# EAGLE design EthernetBridge (EAGLE 6.1)
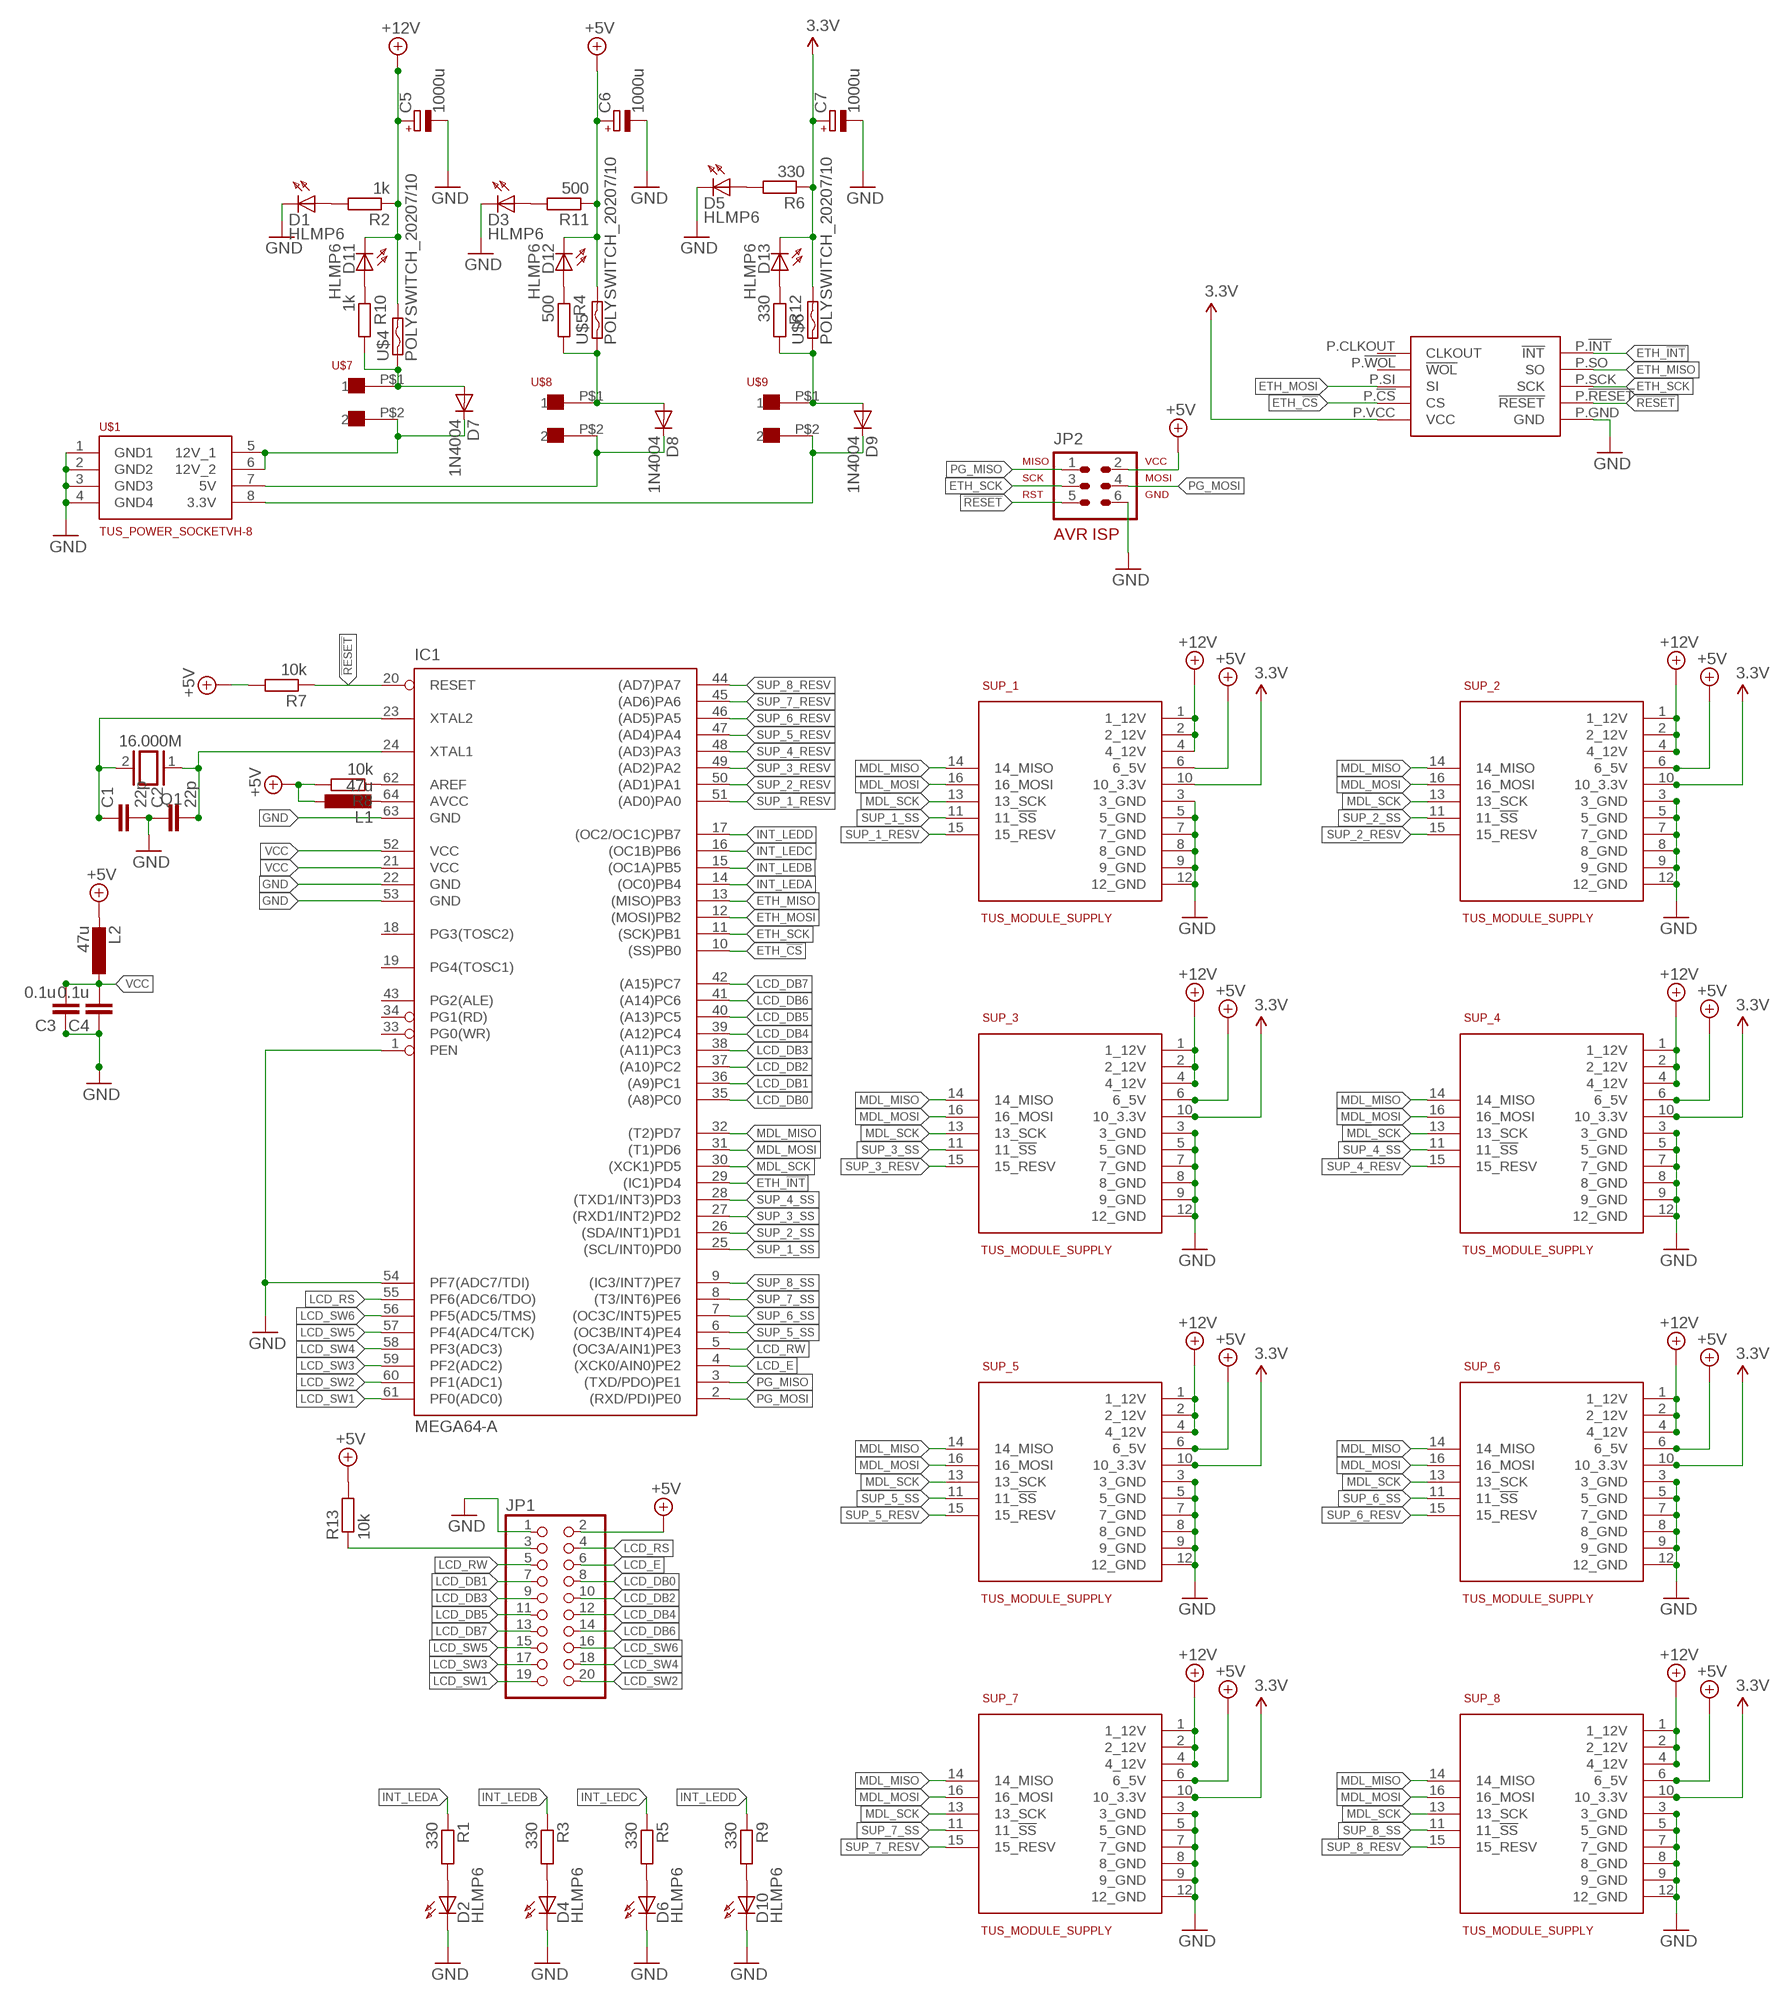
[diagram p0: schematic, sheet 1]

## Parts
C1  22p  C2,5-3  [C2.5-3]
C2  22p  C2,5-3  [C2.5-3]
C3  0.1u  C2,5-3  [C2.5-3]
C4  0.1u  C2,5-3  [C2.5-3]
C5  1000u  CPOL-EUE5-10.5  [E5-10,5]
C6  1000u  CPOL-EUE5-10.5  [E5-10,5]
C7  1000u  CPOL-EUE5-10.5  [E5-10,5]
D1  HLMP6  [HLMP6]
D2  HLMP6  [HLMP6]
D3  HLMP6  [HLMP6]
D4  HLMP6  [HLMP6]
D5  HLMP6  [HLMP6]
D6  HLMP6  [HLMP6]
D7  1N4004  [DO41-10]
D8  1N4004  [DO41-10]
D9  1N4004  [DO41-10]
D10  HLMP6  [HLMP6]
D11  HLMP6  [HLMP6]
D12  HLMP6  [HLMP6]
D13  HLMP6  [HLMP6]
IC1  MEGA64-A  [TQFP64]
JP1  PINHD-2X10  [2X10]
JP2  AVR-ISP-6VERT  [AVR-ISP-6]
L1  47u  L-EU0204/7  [0204/7]
L2  47u  L-EU0204/7  [0204/7]
Q1  16.000M  XTAL/S  [QS]
R1  330  R-EU_0204/7  [0204/7]
R2  1k  R-EU_0204/7  [0204/7]
R3  330  R-EU_0204/7  [0204/7]
R4  500  R-EU_0204/7  [0204/7]
R5  330  R-EU_0204/7  [0204/7]
R6  330  R-EU_0204/7  [0204/7]
R7  10k  R-EU_0204/7  [0204/7]
R8  10k  R-EU_0204/7  [0204/7]
R9  330  R-EU_0204/7  [0204/7]
R10  1k  R-EU_0204/7  [0204/7]
R11  500  R-EU_0204/7  [0204/7]
R12  330  R-EU_0204/7  [0204/7]
R13  10k  R-EU_0204/7  [0204/7]
SUP_1  TUS_MODULE_SUPPLY  [2X08]
SUP_2  TUS_MODULE_SUPPLY  [2X08]
SUP_3  TUS_MODULE_SUPPLY  [2X08]
SUP_4  TUS_MODULE_SUPPLY  [2X08]
SUP_5  TUS_MODULE_SUPPLY  [2X08]
SUP_6  TUS_MODULE_SUPPLY  [2X08]
SUP_7  TUS_MODULE_SUPPLY  [2X08]
SUP_8  TUS_MODULE_SUPPLY  [2X08]
U$1  TUS_POWER_SOCKETVH-8  [VH_8]
U$2  AITENDO_ENC28J60  [AITENDO_ENC28J60]
U$4  POLYSWITCH_20207/10  [0207/10]
U$5  POLYSWITCH_20207/10  [0207/10]
U$6  POLYSWITCH_20207/10  [0207/10]
U$7  VH-2  [VH-2]
U$8  VH-2  [VH-2]
U$9  VH-2  [VH-2]

## Nets
3.3V [supply_3.3v]: C7.+ D13.K R6.1 SUP_1.10(10_3.3V) SUP_2.10(10_3.3V) SUP_3.10(10_3.3V) SUP_4.10(10_3.3V) SUP_5.10(10_3.3V) SUP_6.10(10_3.3V) SUP_7.10(10_3.3V) SUP_8.10(10_3.3V) U$2.P.VCC(VCC) U$6.2
!RESET: IC1.20(RESET) JP2.5 R7.1 U$2.P.!RESET(!RESET)
+5V [supply_5v]: C6.+ D12.K JP1.2 JP2.2 L1.1 L2.2 R7.2 R8.2 R11.1 R13.2 SUP_1.6(6_5V) SUP_2.6(6_5V) SUP_3.6(6_5V) SUP_4.6(6_5V) SUP_5.6(6_5V) SUP_6.6(6_5V) SUP_7.6(6_5V) SUP_8.6(6_5V) U$5.2
+12V [supply_12v]: C5.+ D11.K R2.1 SUP_1.1(1_12V) SUP_1.2(2_12V) SUP_1.4(4_12V) SUP_2.1(1_12V) SUP_2.2(2_12V) SUP_2.4(4_12V) SUP_3.1(1_12V) SUP_3.2(2_12V) SUP_3.4(4_12V) SUP_4.1(1_12V) SUP_4.2(2_12V) SUP_4.4(4_12V) SUP_5.1(1_12V) SUP_5.2(2_12V) SUP_5.4(4_12V) SUP_6.1(1_12V) SUP_6.2(2_12V) SUP_6.4(4_12V) SUP_7.1(1_12V) SUP_7.2(2_12V) SUP_7.4(4_12V) SUP_8.1(1_12V) SUP_8.2(2_12V) SUP_8.4(4_12V) U$4.2
ETH_!CS: IC1.10((SS)PB0) U$2.P.!CS(CS)
ETH_!INT: IC1.29((IC1)PD4) U$2.P.!INT(!INT)
ETH_MISO: IC1.13((MISO)PB3) U$2.P.SO(SO)
ETH_MOSI: IC1.12((MOSI)PB2) U$2.P.SI(SI)
ETH_SCK: IC1.11((SCK)PB1) JP2.3 U$2.P.SCK(SCK)
GND [gnd]: C1.2 C2.1 C3.1 C4.1 C5.- C6.- C7.- D1.K D2.K D3.K D4.K D5.K D6.K D10.K IC1.1(PEN) IC1.22(GND) IC1.53(GND) IC1.54(PF7(ADC7/TDI)) IC1.63(GND) JP1.1 JP2.6 SUP_1.3(3_GND) SUP_1.5(5_GND) SUP_1.7(7_GND) SUP_1.8(8_GND) SUP_1.9(9_GND) SUP_1.12(12_GND) SUP_2.3(3_GND) SUP_2.5(5_GND) SUP_2.7(7_GND) SUP_2.8(8_GND) SUP_2.9(9_GND) SUP_2.12(12_GND) SUP_3.3(3_GND) SUP_3.5(5_GND) SUP_3.7(7_GND) SUP_3.8(8_GND) SUP_3.9(9_GND) SUP_3.12(12_GND) SUP_4.3(3_GND) SUP_4.5(5_GND) SUP_4.7(7_GND) SUP_4.8(8_GND) SUP_4.9(9_GND) SUP_4.12(12_GND) SUP_5.3(3_GND) SUP_5.5(5_GND) SUP_5.7(7_GND) SUP_5.8(8_GND) SUP_5.9(9_GND) SUP_5.12(12_GND) SUP_6.3(3_GND) SUP_6.5(5_GND) SUP_6.7(7_GND) SUP_6.8(8_GND) SUP_6.9(9_GND) SUP_6.12(12_GND) SUP_7.3(3_GND) SUP_7.5(5_GND) SUP_7.7(7_GND) SUP_7.8(8_GND) SUP_7.9(9_GND) SUP_7.12(12_GND) SUP_8.3(3_GND) SUP_8.5(5_GND) SUP_8.7(7_GND) SUP_8.8(8_GND) SUP_8.9(9_GND) SUP_8.12(12_GND) U$1.1(GND1) U$1.2(GND2) U$1.3(GND3) U$1.4(GND4) U$2.P.GND(GND)
INT_LEDA: IC1.14((OC0)PB4) R1.1
INT_LEDB: IC1.15((OC1A)PB5) R3.1
INT_LEDC: IC1.16((OC1B)PB6) R5.1
INT_LEDD: IC1.17((OC2/OC1C)PB7) R9.1
LCD_DB0: IC1.35((A8)PC0) JP1.8
LCD_DB1: IC1.36((A9)PC1) JP1.7
LCD_DB2: IC1.37((A10)PC2) JP1.10
LCD_DB3: IC1.38((A11)PC3) JP1.9
LCD_DB4: IC1.39((A12)PC4) JP1.12
LCD_DB5: IC1.40((A13)PC5) JP1.11
LCD_DB6: IC1.41((A14)PC6) JP1.14
LCD_DB7: IC1.42((A15)PC7) JP1.13
LCD_E: IC1.4((XCK0/AIN0)PE2) JP1.6
LCD_RS: IC1.55(PF6(ADC6/TDO)) JP1.4
LCD_RW: IC1.5((OC3A/AIN1)PE3) JP1.5
LCD_SW1: IC1.61(PF0(ADC0)) JP1.19
LCD_SW2: IC1.60(PF1(ADC1)) JP1.20
LCD_SW3: IC1.59(PF2(ADC2)) JP1.17
LCD_SW4: IC1.58(PF3(ADC3)) JP1.18
LCD_SW5: IC1.57(PF4(ADC4/TCK)) JP1.15
LCD_SW6: IC1.56(PF5(ADC5/TMS)) JP1.16
LCD_VO: JP1.3 R13.1
MDL_MISO: IC1.32((T2)PD7) SUP_1.14(14_MISO) SUP_2.14(14_MISO) SUP_3.14(14_MISO) SUP_4.14(14_MISO) SUP_5.14(14_MISO) SUP_6.14(14_MISO) SUP_7.14(14_MISO) SUP_8.14(14_MISO)
MDL_MOSI: IC1.31((T1)PD6) SUP_1.16(16_MOSI) SUP_2.16(16_MOSI) SUP_3.16(16_MOSI) SUP_4.16(16_MOSI) SUP_5.16(16_MOSI) SUP_6.16(16_MOSI) SUP_7.16(16_MOSI) SUP_8.16(16_MOSI)
MDL_SCK: IC1.30((XCK1)PD5) SUP_1.13(13_SCK) SUP_2.13(13_SCK) SUP_3.13(13_SCK) SUP_4.13(13_SCK) SUP_5.13(13_SCK) SUP_6.13(13_SCK) SUP_7.13(13_SCK) SUP_8.13(13_SCK)
N$2: IC1.64(AVCC) L1.2
N$3: D1.A R2.2
N$4: D2.A R1.2
N$5: D4.A R3.2
N$6 [supply_5v]: D8.A R4.2 U$5.1 U$8.P$1
N$7 [supply_3.3v]: D9.C U$1.8(3.3V) U$9.P$2
N$8: D6.A R5.2
N$9: D5.A R6.2
N$10: C2.2 IC1.24(XTAL1) Q1.1
N$11: D10.A R9.2
N$12: C1.1 IC1.23(XTAL2) Q1.2
N$13: IC1.62(AREF) R8.1
N$14 [supply_12v]: D7.A R10.2 U$4.1 U$7.P$1
N$15: D11.A R10.1
N$17: D3.A R11.2
N$18: D12.A R4.1
N$19: D13.A R12.1
N$20 [supply_3.3v]: D9.A R12.2 U$6.1 U$9.P$1
N$21 [supply_12v]: D7.C U$1.5(12V_1) U$1.6(12V_2) U$7.P$2
N$22 [supply_5v]: D8.C U$1.7(5V) U$8.P$2
PG_MISO: IC1.3((TXD/PDO)PE1) JP2.1
PG_MOSI: IC1.2((RXD/PDI)PE0) JP2.4
SUP_1_RESV: IC1.51((AD0)PA0) SUP_1.15(15_RESV)
SUP_1_SS: IC1.25((SCL/INT0)PD0) SUP_1.11(11_!SS)
SUP_2_RESV: IC1.50((AD1)PA1) SUP_2.15(15_RESV)
SUP_2_SS: IC1.26((SDA/INT1)PD1) SUP_2.11(11_!SS)
SUP_3_RESV: IC1.49((AD2)PA2) SUP_3.15(15_RESV)
SUP_3_SS: IC1.27((RXD1/INT2)PD2) SUP_3.11(11_!SS)
SUP_4_RESV: IC1.48((AD3)PA3) SUP_4.15(15_RESV)
SUP_4_SS: IC1.28((TXD1/INT3)PD3) SUP_4.11(11_!SS)
SUP_5_RESV: IC1.47((AD4)PA4) SUP_5.15(15_RESV)
SUP_5_SS: IC1.6((OC3B/INT4)PE4) SUP_5.11(11_!SS)
SUP_6_RESV: IC1.46((AD5)PA5) SUP_6.15(15_RESV)
SUP_6_SS: IC1.7((OC3C/INT5)PE5) SUP_6.11(11_!SS)
SUP_7_RESV: IC1.45((AD6)PA6) SUP_7.15(15_RESV)
SUP_7_SS: IC1.8((T3/INT6)PE6) SUP_7.11(11_!SS)
SUP_8_RESV: IC1.44((AD7)PA7) SUP_8.15(15_RESV)
SUP_8_SS: IC1.9((IC3/INT7)PE7) SUP_8.11(11_!SS)
VCC: C3.2 C4.2 IC1.21(VCC) IC1.52(VCC) L2.1
Unconnected: IC1.18(PG3(TOSC2)) IC1.19(PG4(TOSC1)) IC1.33(PG0(WR)) IC1.34(PG1(RD)) IC1.43(PG2(ALE)) U$2.P.!WOL(!WOL) U$2.P.CLKOUT(CLKOUT)

## Library data of the parts
C1-C4 = capacitor-wima:C: CAPACITOR naming: grid - package width
C5-C7 = rcl:CPOL-EU: POLARIZED CAPACITOR, European symbol
D1-D6 D10-D13 = display-hp:HLMP6: LED 2mm horizontal; MF: AGILENT TECHNOLOGIES; MPN: HLMP-6500; OC_FARNELL: 1652490; OC_NEWARK: 40K0088
D7-D9 = diode:1N4004: DIODE general purpose rectifier, 1 A
IC1 = atmel:MEGA64: MICROCONTROLLER 64 Kbytes FLASH 4 Kbytes SRAM 2 Kbytes EEPROM DUAL USART 8-channel 10 bit ADC Source: avr.lbr; MPN: ATMEGA64-16AU; OC_FARNELL: 9171355; OC_NEWARK: 01M6899
JP1 = pinhead:PINHD-2X10: PIN HEADER
JP2 = avr-7:AVR-ISP-6: AVR ISP-6 Serial Programming Header
L1 L2 = myparts:L-EU: INDUCTOR, European symbol
Q1 = special:XTAL/S: CRYSTAL
R1-R13 = rcl:R-EU_: RESISTOR, European symbol
SUP_1-SUP_8 = myparts:TUS_MODULE_SUPPLY
U$1 = myparts:TUS_POWER_SOCKET
U$2 = myparts:AITENDO_ENC28J60
U$4-U$6 = myparts:POLYSWITCH_2
U$7-U$9 = myparts:VH-2

## Net classes
1 supply_12v: width 2.54 mm, drill 1.016 mm, clearance 0.508 mm
2 supply_5v: width 1.27 mm, drill 0.508 mm, clearance 0.508 mm
3 supply_3.3v: width 1.27 mm, drill 0.508 mm, clearance 0.508 mm
4 gnd: width 0.254 mm, drill 1.016 mm

## Board
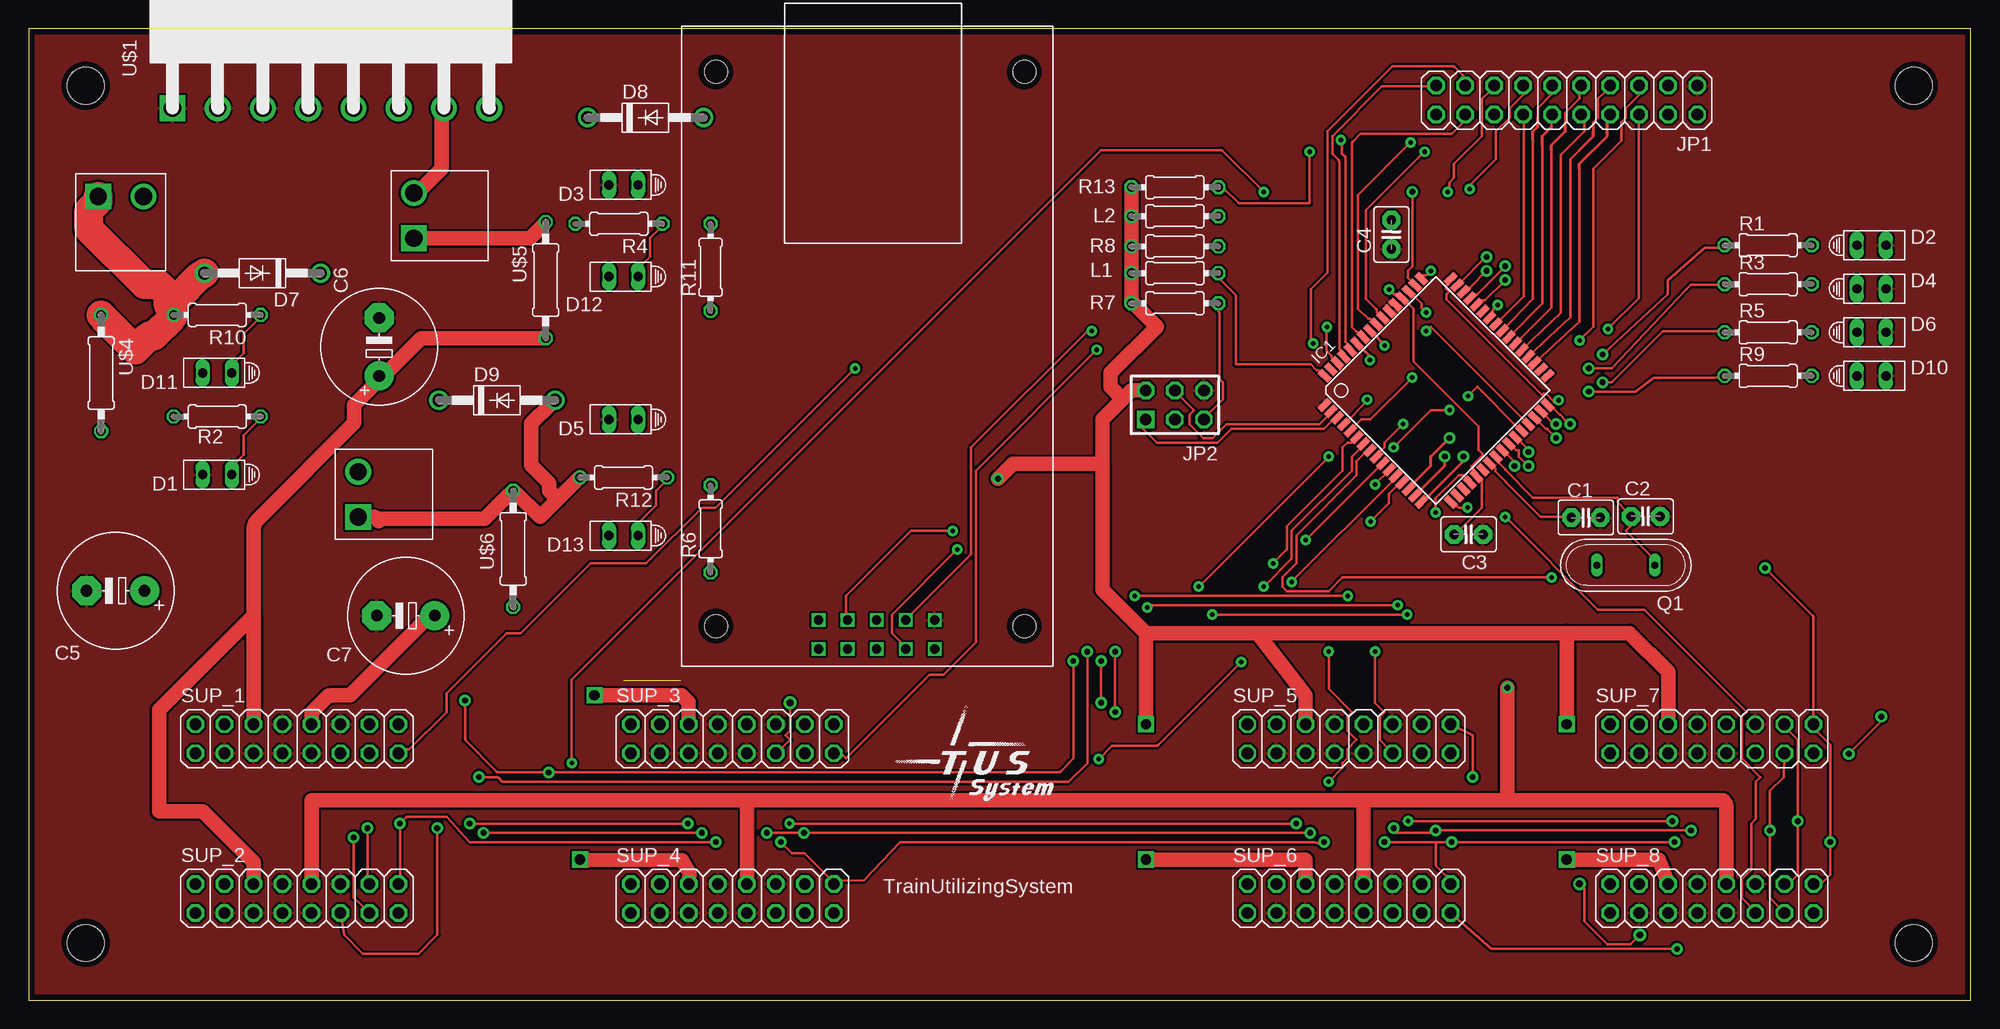
[diagram p1: board, top side]
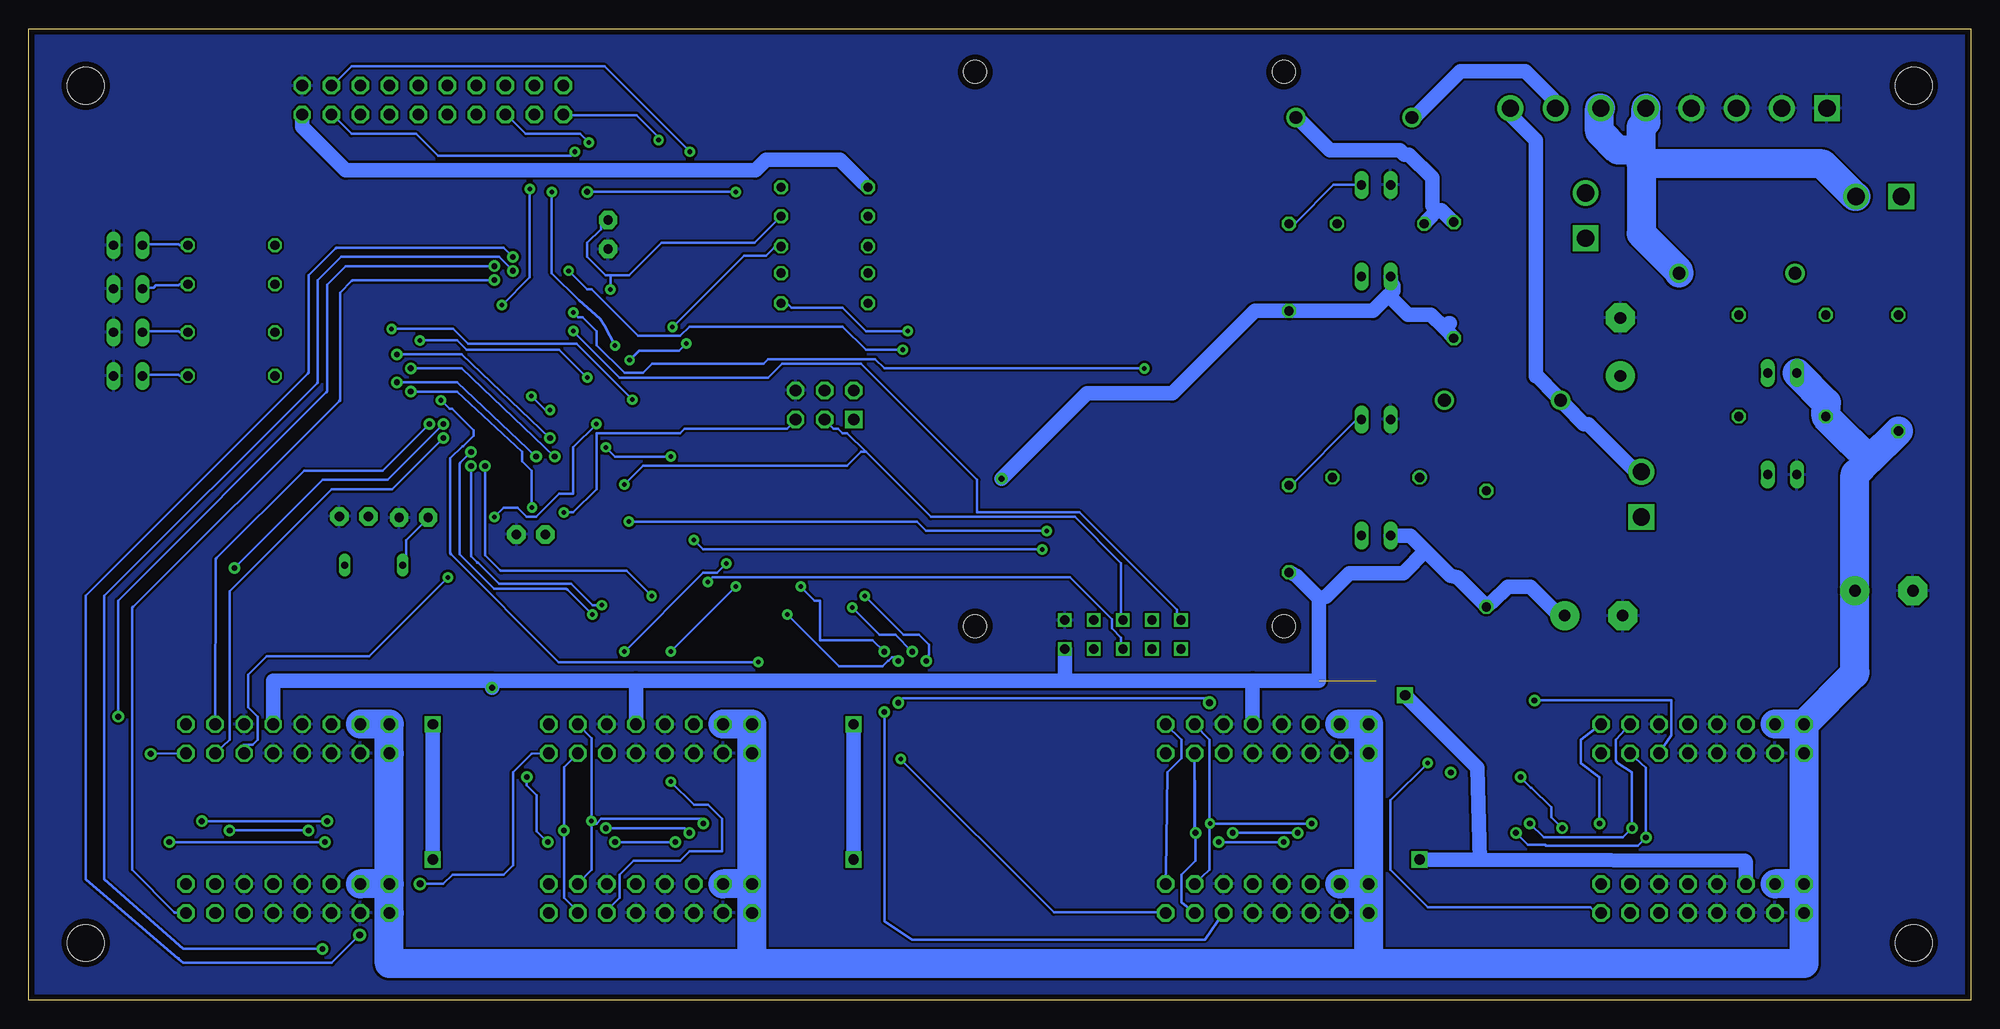
[diagram p2: board, bottom side, seen from below]

Size 170 x 85 mm. Coordinates in mm from the lower left corner, seen from the top.
Outline: 0,0 170,0 170,85 0,85 0,0
Copper layers (1*16): Top 0.14mm / dielectric 1.29mm / Bottom 0.14mm
Design rules: minimum track width 8mil, minimum drill 0.4mm, track to track 8mil, track to pad 8mil, pad to pad 8mil, via to via 8mil, smd to smd 8mil, copper to edge 20mil, drill to drill 8mil, minimum pad ring 8mil, minimum via ring 10mil, stop-mask expansion 3mil, vias tented up to drill 0mil, thermal gap 8mil
Holes 3.2 mm at 165,5 5,5 5,80 165,80
vRestrict: area 73.6,13.8 to 92.3,26; area 73.6,1.2 to 104.4,11

### Footprints (pad centres in the part's own frame; a part is rotated, then mirrored left to right if it is on the bottom)
C2.5-3 = drill 0.813 pad 1.6 octagon: 1 -1.27,0; 2 1.27,0
E5-10,5 = drill 1.016 pad 2.54: + -2.54,0 | drill 1.016 pad 2.54 octagon: - 2.54,0
HLMP6 = drill 0.813 long: A -1.27,0; K 1.27,0
DO41-10 = drill 1.118: A 5.08,0; C -5.08,0
TQFP64 = smd 1.194 x 0.559: 1 -7.8,6; 2 -7.8,5.2; 3 -7.8,4.4; 4 -7.8,3.6; 5 -7.8,2.8; 6 -7.8,2; 7 -7.8,1.2; 8 -7.8,0.4; 9 -7.8,-0.4; 10 -7.8,-1.2; 11 -7.8,-2; 12 -7.8,-2.8; 13 -7.8,-3.6; 14 -7.8,-4.4; 15 -7.8,-5.2; 16 -7.8,-6; 33 7.8,-6; 34 7.8,-5.2; 35 7.8,-4.4; 36 7.8,-3.6; 37 7.8,-2.8; 38 7.8,-2; 39 7.8,-1.2; 40 7.8,-0.4; 41 7.8,0.4; 42 7.8,1.2; 43 7.8,2; 44 7.8,2.8; 45 7.8,3.6; 46 7.8,4.4; 47 7.8,5.2; 48 7.8,6 | smd 0.559 x 1.194: 17 -6,-7.8; 18 -5.2,-7.8; 19 -4.4,-7.8; 20 -3.6,-7.8; 21 -2.8,-7.8; 22 -2,-7.8; 23 -1.2,-7.8; 24 -0.4,-7.8; 25 0.4,-7.8; 26 1.2,-7.8; 27 2,-7.8; 28 2.8,-7.8; 29 3.6,-7.8; 30 4.4,-7.8; 31 5.2,-7.8; 32 6,-7.8; 49 6,7.8; 50 5.2,7.8; 51 4.4,7.8; 52 3.6,7.8; 53 2.8,7.8; 54 2,7.8; 55 1.2,7.8; 56 0.4,7.8; 57 -0.4,7.8; 58 -1.2,7.8; 59 -2,7.8; 60 -2.8,7.8; 61 -3.6,7.8; 62 -4.4,7.8; 63 -5.2,7.8; 64 -6,7.8
2X10 = drill 1.016 octagon: 1 -11.43,-1.27; 2 -11.43,1.27; 3 -8.89,-1.27; 4 -8.89,1.27; 5 -6.35,-1.27; 6 -6.35,1.27; 7 -3.81,-1.27; 8 -3.81,1.27; 9 -1.27,-1.27; 10 -1.27,1.27; 11 1.27,-1.27; 12 1.27,1.27; 13 3.81,-1.27; 14 3.81,1.27; 15 6.35,-1.27; 16 6.35,1.27; 17 8.89,-1.27; 18 8.89,1.27; 19 11.43,-1.27; 20 11.43,1.27
AVR-ISP-6 = drill 1.016 square: 1 -2.54,-1.27 | drill 1.016 octagon: 2 -2.54,1.27; 3 0,-1.27; 4 0,1.27; 5 2.54,-1.27; 6 2.54,1.27
0204/7 = drill 0.813 octagon: 1 -3.81,0; 2 3.81,0
QS = drill 0.61 long: 1 -2.54,0; 2 2.54,0
2X08 = drill 1.016 octagon: 1 -8.89,-1.27; 2 -8.89,1.27; 3 -6.35,-1.27; 4 -6.35,1.27; 5 -3.81,-1.27; 6 -3.81,1.27; 7 -1.27,-1.27; 8 -1.27,1.27; 9 1.27,-1.27; 10 1.27,1.27; 11 3.81,-1.27; 12 3.81,1.27; 13 6.35,-1.27; 14 6.35,1.27; 15 8.89,-1.27; 16 8.89,1.27
VH_8 = drill 1.5 square: 1 0,0 | drill 1.5: 2 3.96,0; 3 7.92,0; 4 11.88,0; 5 15.84,0; 6 19.8,0; 7 23.76,0; 8 27.72,0
AITENDO_ENC28J60 = drill 0.8 square: P.!CS 19.62,1.5; P.!INT 12,4.04; P.!RESET 19.62,4.04; P.!WOL 14.54,1.5; P.CLKOUT 12,1.5; P.GND 22.16,4.04; P.SCK 17.08,4.04; P.SI 17.08,1.5; P.SO 14.54,4.04; P.VCC 22.16,1.5 | hole 2: 3,3.5; 30,3.5; 3,52; 30,52
0207/10 = drill 0.813 octagon: 1 -5.08,0; 2 5.08,0
VH-2 = drill 1.5 square: P$1 0,0 | drill 1.5: P$2 3.96,0

### Placement (x,y rotation side)
C1  136.3,42.21 0 top
C2  141.53,42.32 180 top
C3  126.03,40.74 180 top
C4  119.28,66.98 90 top
C5  470u  [E5-10,5]  7.62,35.81 180 top
C6  470u  [E5-10,5]  30.68,57.15 90 top
C7  470u  [E5-10,5]  33.02,33.63 180 top
D1  16.51,45.97 180 top
D2  161.29,66.04 0 top
D3  52.07,71.32 180 top
D4  161.29,62.23 0 top
D5  52.07,50.8 180 top
D6  161.29,58.42 0 top
D7  20.47,63.6 180 top
D8  54,77.22 0 top
D9  41,52.48 0 top
D10  161.29,54.61 0 top
D11  16.51,54.86 180 top
D12  52.07,63.3 180 top
D13  52.07,40.64 180 top
IC1  123.19,53.34 45 top
JP1  134.62,78.74 180 top
JP2  100.33,52.07 0 top
L1  100.33,63.6 0 top
L2  100.33,68.58 180 top
Q1  139.8,38.05 180 top
R1  152.25,66.04 0 top
R2  16.51,51.05 0 top
R3  152.25,62.64 0 top
R4  51.66,67.92 180 top
R5  152.25,58.42 0 top
R6  59.69,41.22 90 top
R7  100.33,60.96 180 top
R8  100.33,65.94 180 top
R9  152.25,54.61 0 top
R10  16.51,59.94 180 top
R11  59.69,64.11 90 top
R12  52.07,45.72 180 top
R13  100.33,71.12 180 top
SUP_1  23.5,22.86 0 top
SUP_2  23.5,8.89 0 top
SUP_3  61.59,22.86 0 top
SUP_4  61.59,8.89 0 top
SUP_5  115.57,22.86 0 top
SUP_6  115.57,8.89 0 top
SUP_7  147.32,22.86 0 top
SUP_8  147.32,8.89 0 top
U$1  12.6,78.03 0 top
U$2  57.15,29.21 0 top
U$4  6.35,54.86 270 top
U$5  45.26,62.99 270 top
U$6  42.42,39.47 270 top
U$7  6.1,70.31 0 top
U$8  33.73,66.65 90 top
U$9  28.85,42.27 90 top

### Tracks (layer width: path | path; a pad name or v marks a point on that pad's centre or on a via)
3.3V  (via drill 0.51)  (1 unrouted)
  Top 1.27: 117.04,17.48 129.44,17.48 | 129.44,17.48 148.34,17.48 arc-45 148.59,16.86 SUP_8.10 | 62.99,17.48 117.04,17.48 | SUP_2.10 24.77,17.41 arc-45 24.79,17.48 62.99,17.48 | SUP_6.10 116.84,16.98 arc-45 117.04,17.48 | SUP_4.10 62.87,17.24 arc-45 62.94,17.42 62.99,17.48 | 129.44,17.48 v129.44,27.33 | C7.+ 35.36,33.43 35.31,33.48 34.95,33.48 28.14,26.67 26.52,26.67 26.47,26.62 26.21,26.62 24.79,25.2 24.79,24.13 SUP_1.10
  Bottom 1.27: 62.87,27.94 57.05,27.94 57.05,35.15 | 62.87,27.94 SUP_3.10 | U$2.P.VCC 79.31,28 79.38,27.94 | 79.38,27.94 62.87,27.94 | 116.84,27.94 79.38,27.94 | 116.84,27.94 SUP_5.10 | SUP_7.10 148.59,27.94 129.44,27.94 | 129.44,27.94 116.84,27.94 | R6.1 59.69,37.44 59.59,37.44 59.03,37.13 57.05,35.15 | v129.44,27.33 129.44,27.94 | D13.K 49.07,40.64 47.73,39.29 | 47.73,39.29 45.57,37.13 44.96,36.98 42.42,34.44 | 57.05,35.15 56.44,35.31 54.41,37.34 49.68,37.34 47.73,39.29 | 42.42,34.44 U$6.2 | C7.+ 36.02,33.63 38.56,36.17 40.54,36.17 41.91,34.8 42.42,34.44
!RESET  (via drill 0.4)
  Top 0.203: R7.1 104.14,60.25 104.24,60.15 104.24,54.36 104.55,54.05 104.55,52.58 103.28,51.31 102.87,51.31 JP2.5 | v123.14,42.67 123.14,43.89 125.17,45.92 125.58,45.92 125.98,45.52 IC1.20 | U$2.P.!RESET 76.81,33.33 82.5,39.01 82.5,48.36 92.66,58.52 v93.07,58.52
  Bottom 0.203: JP2.5 102.82,50.8 103.63,49.99 112.57,49.99 112.98,49.58 120.29,49.58 120.29,44.7 122.33,42.67 v123.14,42.67 | v93.07,58.52 96.72,58.52 98.75,60.55 103.23,60.55 103.63,60.96 R7.1
+5V  (via drill 0.51, 0.9)
  Top 1.27: 19.68,33.66 SUP_1.6 | SUP_2.6 19.68,12.06 15.24,16.51 11.43,16.51 11.43,25.4 19.68,33.66 | SUP_4.6 57.84,11.1 57.2,12.24 v48.26,12.29 | SUP_3.6 57.78,26.04 57.15,26.67 v49.53,26.67 | JP2.2 96.52,53.34 95.76,52.58 | 95.76,52.58 93.98,50.8 93.98,46.94 | 93.98,46.94 93.98,35.92 97.79,32.11 | 97.79,32.11 107.54,32.11 | 107.54,32.11 111.76,26.67 SUP_5.6 | SUP_6.6 111.76,12.29 v97.79,12.29 | 97.79,32.11 v97.79,24.13 | SUP_7.6 143.51,28.7 140.11,32.11 134.62,32.11 | 107.54,32.11 134.62,32.11 | SUP_8.6 142.7,12.29 v134.62,12.29 | 134.62,32.11 v134.62,24.13 | v84.84,45.62 86.16,46.94 93.98,46.94 | 19.68,33.66 19.68,41.1 arc-45 20.06,42 20.47,42.47 28.5,50.49 28.5,52.07 30.43,54 30.43,54.36 C6.+ 30.89,54.46 34.34,57.91 U$5.2 | 95.76,52.58 94.69,53.65 94.69,54.86 98.75,58.93 96.72,60.96 R7.2 L1.1 R8.2 L2.2 R13.2
  Bottom 1.27: 42.98,12.29 19.81,12.19 19.68,12.06 SUP_2.6 | 42.98,12.29 v48.26,12.29 | v49.53,26.67 43.18,20.32 42.98,12.29 | v97.79,24.13 v97.79,12.29 | v134.62,24.13 v134.62,12.29 | JP1.2 146.05,76.4 142.24,72.59 106.38,72.59 105.46,73.51 98.96,73.51 96.98,71.53 R13.2 | v84.84,45.62 77.37,53.09 69.9,53.09 62.76,60.23 arc45 62.58,60.3 R11.1 52.32,60.3 50.98,61.65 | D12.K 50.75,63.25 50.75,62.69 50.55,62.48 50.55,62.08 50.98,61.65 | U$5.2 45.26,57.96 46.1,58.8 | 46.1,58.8 47.24,59.94 49.28,59.94 50.98,61.65 | 45.62,59.23 45.67,59.23 46.1,58.8
+12V
  Bottom 2.54: SUP_1.2 SUP_1.4 | SUP_1.2 SUP_1.1 SUP_2.2 | SUP_2.2 SUP_2.4 | SUP_2.2 SUP_2.1 14.61,3.17 52.7,3.17 | 52.7,3.17 SUP_4.1 SUP_4.2 | SUP_4.2 SUP_4.4 | SUP_4.2 SUP_3.1 SUP_3.2 SUP_3.4 | 106.68,3.17 SUP_6.1 SUP_6.2 | 52.7,3.17 106.68,3.17 | SUP_6.2 SUP_6.4 | SUP_6.2 SUP_5.1 SUP_5.2 SUP_5.4 | 106.68,3.17 138.43,3.17 SUP_8.1 SUP_8.2 | SUP_8.2 SUP_8.4 | SUP_8.2 SUP_7.1 SUP_7.2 SUP_7.4 | 8.79,47.35 U$4.2 | 8.79,47.35 9.75,48.16 10.41,48.82 10.46,48.82 R2.1 12.65,52.27 D11.K | SUP_1.2 10.23,28.5 arc-45 10.16,28.68 C5.+ 10.16,45.87 arc45 10.09,46.05 8.79,47.35
ETH_!CS  (via drill 0.4)
  Top 0.203: v111.76,40.23 118.26,46.74 IC1.10 | v81.28,39.42 75.59,33.73 75.59,32.11 76.81,30.89 U$2.P.!CS
  Bottom 0.203: v111.76,40.23 110.95,39.42 v81.28,39.42
ETH_!INT  (via drill 0.4)
  Top 0.203: 131.29,50.37 IC1.29 131.27,50.39 122.73,58.93 v122.33,58.52
  Bottom 0.203: v122.33,58.52 118.26,54.46 105.26,54.46 104.04,55.68 97.13,55.68 86.97,45.52 86.97,42.67 78.03,42.67 69.49,34.14 69.49,33.33 U$2.P.!INT
ETH_MISO  (via drill 0.4)
  Top 0.203: v117.45,41.86 119.08,43.48 119.08,44.3 119.89,45.11 IC1.13 | U$2.P.SO 71.53,33.33 71.53,35.36 77.22,41.05 v80.87,41.05
  Bottom 0.203: v117.45,41.86 92.25,41.86 91.44,41.05 v80.87,41.05
ETH_MOSI  (via drill 0.4)
  Top 0.203: v110.54,36.58 119.48,45.52 IC1.12
  Bottom 0.203: v110.54,36.58 110.13,36.98 78.84,36.98 75.18,33.33 75.18,32.51 74.37,31.7 74.37,30.89 U$2.P.SI
ETH_SCK  (via drill 0.4)
  Top 0.203: v117.86,45.11 119.08,46.33 IC1.11
  Bottom 0.203: 96.72,47.95 91.03,42.27 78.44,42.27 74.37,38.2 74.37,33.33 U$2.P.SCK | 96.72,47.95 98.35,49.58 98.75,49.58 99.16,49.99 99.57,49.99 100.38,50.8 JP2.3 | v117.86,45.11 116.23,46.74 98.35,46.74 97.13,47.95 96.72,47.95
GND
  pour Bottom: -0.46,85.6 -1.32,-0.86 171.6,-0.91 170.33,85.24
  pour Top: -1.42,-1.37 171.3,-0.61 171.25,85.75 -1.07,85.75
INT_LEDA  (via drill 0.5)
  Top 0.203: v137.77,56.49 143.46,61.77 143.46,62.99 146.71,65.84 147.93,65.84 R1.1
  Top 0.254: IC1.14 120.79,44.79 122.73,46.74 122.73,47.55 v124.36,49.17
  Bottom 0.203: v124.36,49.17 132.08,56.49 v137.77,56.49
INT_LEDB  (via drill 0.5)
  Top 0.203: v136.55,55.27 138.58,55.27 145.09,62.18 145.49,62.59 147.93,62.59 R3.1
  Top 0.254: IC1.15 121.36,44.15 123.95,46.74 v123.95,47.55
  Bottom 0.203: v123.95,47.55 132.08,55.27 v136.55,55.27
INT_LEDC  (via drill 0.5)
  Top 0.203: v137.77,54.05 138.58,54.05 143.05,58.52 147.93,58.52 R5.1
  Top 0.254: IC1.16 122.02,43.58 125.58,47.14 v125.58,47.55
  Bottom 0.203: v125.58,47.55 132.49,54.05 v137.77,54.05
INT_LEDD  (via drill 0.4, 0.5)
  Top 0.203: IC1.17 125.17,43.08 v125.93,43.08 125.98,43.08 | v136.55,53.24 140.61,53.24 142.24,54.46 147.52,54.46 R9.1
  Bottom 0.203: v136.55,53.24 132.49,53.24 126.8,47.95 126.8,47.14 125.98,46.33 125.98,43.08 v125.93,43.08
LCD_DB0
  Top 0.203: IC1.35 135.74,59.33 135.74,72.75
  Top 0.254: 135.74,72.75 135.74,73.15 138.18,75.59 138.18,77.22 JP1.8
LCD_DB1
  Top 0.203: IC1.36 134.93,59.74 134.93,73.56 135.74,74.37 | 136.96,76 136.96,76.81 137.36,77.22 137.36,78.84 138.18,79.65 JP1.7
  Top 0.254: 135.74,74.37 136.96,75.59 136.96,76
LCD_DB2
  Top 0.203: IC1.37 133.3,59.33 134.11,60.15 134.11,73.97 136.14,76 136.14,77.22 JP1.10
LCD_DB3
  Top 0.203: 133.3,74.37 133.3,60.55 IC1.38 | 134.52,76.81 134.52,77.62 135.74,78.84 135.74,79.65 JP1.9
  Top 0.254: 133.3,74.37 133.3,74.78 134.52,76 134.52,76.81
LCD_DB4
  Top 0.203: 132.49,74.78 132.49,60.96 IC1.39 | 133.3,76.4 133.3,77.22 JP1.12
  Top 0.254: 132.49,74.78 132.49,75.59 133.3,76.4
LCD_DB5
  Top 0.203: 131.67,75.18 131.67,61.37 IC1.40 | 132.08,77.22 132.08,78.03 133.3,79.25 133.3,79.65 JP1.11
  Top 0.254: 131.67,75.18 131.67,76 132.08,76.4 132.08,77.22
LCD_DB6
  Top 0.203: JP1.14 130.81,76.96 130.86,76.91 130.86,61.57 128.47,59.18 IC1.41
LCD_DB7  (via drill 0.4)
  Top 0.203: v128.57,60.81 128.22,60.45 128.22,60.35 128.07,60.2 128.07,59.94 127.86,59.74 IC1.42 | JP1.13 130.86,79.65 130.86,79.25 129.64,78.03 129.64,77.22 128.42,76 128.42,73.56 125.98,71.12 v126.14,70.97
  Bottom 0.203: v128.57,60.81 126.14,63.25 v126.14,70.97
LCD_E  (via drill 0.4)
  Top 0.203: v117.14,52.53 117.14,52.38 115.16,50.39 IC1.4 | v138.23,58.73 140.92,61.42 140.92,76.91 140.97,76.96 JP1.6
  Bottom 0.203: v117.14,52.53 122.02,57.4 131.52,57.4 132.84,58.73 v138.23,58.73
LCD_RS  (via drill 0.4)
  Top 0.203: IC1.55 118.52,59.74 118.47,59.74 118.01,60.2 118.01,60.3 arc45 117.93,60.48 117.04,61.37 117.04,69.09 v122.17,74.22
  Bottom 0.203: v122.17,74.22 122.53,73.86 134.16,73.86 136.09,75.79 141.73,75.79 143,77.06 143,77.47 JP1.4
LCD_RW  (via drill 0.4)
  Top 0.203: v121.11,54.46 117.45,50.8 116.64,50.8 115.82,49.99 IC1.5 | v135.74,57.71 136.96,58.93 136.96,72.75 139.4,75.18 139.4,76.81 139.8,77.22 139.8,78.03 141.43,79.65 141.02,80.06 JP1.5
  Bottom 0.203: v121.11,54.46 123.55,56.9 131.67,56.9 132.49,57.71 v135.74,57.71
LCD_SW1
  Top 0.203: JP1.19 123.19,79.96 118.47,79.96 114.1,75.59 114.1,74.17 arc45 114.17,73.99 114.63,73.53 arc-45 114.71,73.35 114.71,57 114.81,56.9 114.81,56.59 115.06,56.34 115.11,56.34 IC1.61
LCD_SW2  (via drill 0.4)
  Top 0.203: v114.86,75.23 114.96,75.13 114.96,74.07 115.19,73.84 arc-45 115.27,73.66 115.27,57.61 115.52,57.35 115.52,57.3 115.67,57.15 IC1.60
  Top 0.254: IC1.60 115.69,57.02
  Bottom 0.203: v114.86,75.23 114.86,75.49 116.79,77.42 122.63,77.42 122.68,77.47 JP1.20
LCD_SW3  (via drill 0.4)
  Top 0.203: 116.69,57.05 116.33,57.4 116.28,57.4 IC1.59 | v112.42,57.45 112.22,57.66 112.22,62.18 113.69,63.65 113.69,76 119.38,81.69 124.66,81.69 arc-45 124.84,81.61 125.58,80.87 125.58,80.27 arc45 125.65,80.09 JP1.17
  Top 0.254: v117.4,55.98 117.4,56.34 116.69,57.05
  Bottom 0.203: 116.59,56.79 113.08,56.79 v112.42,57.45
  Bottom 0.254: 116.59,56.79 v117.4,55.98
LCD_SW4
  Top 0.203: IC1.58 116.79,58.01 116.74,58.01 116.23,58.52 116.18,58.52 115.82,58.88 115.82,74.93 arc-45 115.9,75.11 116.59,75.79 124.56,75.79 125.58,76.81 125.58,77.21 arc-45 125.65,77.39 JP1.18
LCD_SW5  (via drill 0.4)
  Top 0.203: v118.67,57.25 117.96,58.06 117.45,58.57 IC1.57 | JP1.15 128.02,79.65 127.2,78.84 127.2,75.59 124.77,73.15 124.77,71.93 124.36,71.53 124.36,70.71 v124.21,70.71
  Bottom 0.203: v118.67,57.25 119.58,58.98 119.99,59.59 121.82,61.21 124.21,63.6 v124.21,70.71
LCD_SW6  (via drill 0.4)
  Top 0.203: v120.95,75.03 116.33,70.41 116.33,60.5 117.25,59.59 117.45,59.59 117.86,59.18 117.91,59.18 IC1.56
  Bottom 0.203: v120.95,75.03 121.72,75.79 126.49,75.79 127.76,77.06 127.76,77.47 JP1.16
LCD_VO  (via drill 0.4)
  Top 0.203: R13.1 104.6,71.12 104.6,71.02 105.92,69.7 112.12,69.7 v112.12,74.22
  Bottom 0.203: v112.12,74.22 119.58,81.69 141.73,81.69 143,80.42 143,80.01 JP1.3
MDL_MISO  (via drill 0.4, 0.5)
  Top 0.203: v29.67,15.04 29.67,10.16 SUP_2.14 | v38.61,15.44 v57.71,15.44 | 120.7,15.85 v120.75,15.65 v143.87,15.65 | v66.6,15.44 v110.95,15.44 | v134.93,50.39 134.77,50.39 134.52,50.65 134.52,50.75 134.06,51.21 134.01,51.21 133.4,51.82 133.25,51.82 133.04,52.02 132.99,52.02 IC1.32 | SUP_8.14 153.92,10.16 arc45 154.1,10.23 154.84,10.97 v154.84,15.65 154.84,22.76 153.74,23.85 arc-45 153.67,24.03 SUP_7.14
  Bottom 0.203: SUP_7.14 153.62,38.2 153.62,38.5 arc45 153.54,38.68 145.9,46.33 138.99,46.33 v134.93,50.39 | SUP_3.14 66.65,22.76 66.65,15.85 | 66.65,15.85 66.65,11.38 SUP_4.14 | SUP_1.14 31.09,22.76 31.09,20.93 30.89,20.73 29.67,19.91 v29.67,15.04 30.48,14.22 37.39,14.22 v38.61,15.44 | v57.71,15.44 v66.6,15.44 66.65,15.85 | SUP_6.14 120.7,11.38 120.7,15.44 | SUP_5.14 120.7,22.91 120.7,15.85 | v143.87,15.65 v154.84,15.65 | 120.7,15.44 120.7,15.85 | 120.7,15.44 120.29,15.44 119.89,15.85 110.95,15.85 v110.95,15.44 | 120.7,15.85 v120.75,15.65
MDL_MOSI  (via drill 0.5)
  Top 0.203: v32.51,15.44 32.51,10.16 SUP_2.16 | v32.51,15.44 32.92,15.44 | v60.15,13.82 38.61,13.82 36.58,16.05 33.23,16.05 arc45 33.05,15.98 v32.51,15.44 | SUP_5.16 126.39,23.16 v126.39,19.51 | v144.07,13.82 v124.56,13.82 123.19,13.82 | v118.67,13.82 123.19,13.82 | v133.71,50.39 133.5,50.39 132.44,51.46 132.38,51.46 IC1.31 | v65.84,13.82 66.8,12.85 67.92,12.85 70.51,10.26 70.51,10.16 SUP_4.16 70.46,10.41 73.1,10.46 76.25,13.82 112.52,13.82 112.83,13.72 113.39,13.72 v113.39,13.82 | SUP_6.16 124.46,10.46 123.19,11.73 123.19,13.82 | SUP_8.16 156.76,10.16 arc45 156.94,10.23 157.68,10.97 v157.68,13.82 157.68,22.35 156.28,23.75 arc-45 156.21,23.93 SUP_7.16 156.21,33.47 arc45 156.14,33.65 v151.99,37.8
  Bottom 0.203: SUP_4.16 70.43,13.41 | 70.43,13.41 70.42,13.83 70.31,19.91 69.09,21.13 69.09,22.76 SUP_3.16 | SUP_1.16 34.14,22.76 34.14,20.73 32.51,19.51 v32.51,15.44 | v60.15,13.82 v65.84,13.82 | 70.43,13.41 70.42,13.42 | v144.07,13.82 v157.68,13.82 | v113.39,13.82 v118.67,13.82 | v124.56,13.82 125.53,14.78 125.53,17.93 126.39,18.8 v126.39,19.51 | v133.71,50.39 138.58,45.52 144.27,45.52 v151.99,37.8
MDL_SCK  (via drill 0.5)
  Top 0.203: SUP_7.13 153.62,19.51 152.4,18.29 v152.4,14.83 152.4,8.94 SUP_8.13 | SUP_2.13 28.45,8.94 v28.45,14.22 | v64.62,14.63 v67.87,14.63 v112.17,14.63 | v39.83,14.63 v58.93,14.63 | v133.71,49.17 132.94,49.94 132.94,49.99 132.79,49.99 131.88,50.9 131.83,50.9 IC1.30 | v119.48,15.04 119.48,14.63 122.73,14.63 v123.14,14.83 v145.49,14.83
  Bottom 0.203: SUP_7.13 152.4,22.76 152.4,35.76 143.46,44.7 138.18,44.7 v133.71,49.17 | SUP_4.13 69.09,8.53 69.09,10.97 67.87,12.19 | 67.87,12.19 SUP_3.13 67.94,14.3 v67.87,14.63 67.87,12.19 | SUP_1.13 28.45,20.32 v28.45,14.22 29.16,13.51 37.19,13.51 37.24,13.56 38.76,13.56 v39.83,14.63 | v58.93,14.63 v64.62,14.63 | SUP_6.13 121.92,7.72 123.14,8.94 v123.14,14.83 123.14,20.37 SUP_5.13 | v145.49,14.83 v152.4,14.83 | v119.48,15.04 112.57,15.04 v112.17,14.63
N$2
  Top 0.203: L1.2 104.14,63.2 105.66,61.67 105.66,55.63 112.22,55.63 112.72,55.12 112.88,55.12 113.33,54.66 113.39,54.66 IC1.64
N$3
  Top 0.203: D1.A 18.14,46.33 18.14,46.99 18.85,47.7 18.85,49.43 20.02,50.6 20.02,50.75 R2.2
N$4
  Bottom 0.203: R1.2 156.77,66.04 156.87,66.14 159.46,66.14 159.56,66.04 D2.A
N$5
  Bottom 0.203: R3.2 156.77,62.64 156.87,62.53 158.85,62.53 159.06,62.33 159.46,62.33 159.56,62.23 D4.A
N$6
  Top 1.27: U$8.P$1 43.89,66.65 45.11,67.87 U$5.1
  Bottom 1.27: 46.74,69.09 46.33,69.09 45.52,68.28 U$5.1 | 46.74,69.09 47.55,68.28 R4.2 | D8.A 58.93,77.22 56.08,74.37 49.99,74.37 49.58,73.97 49.17,73.97 47.14,71.93 47.14,69.49 46.74,69.09
N$7
  Bottom 1.27: U$1.8 40.28,78.03 40.28,77.42 38.1,75.23 38.1,54.56 37.95,54.56 36.32,52.93 D9.C 35.51,52.02 33.88,50.39 33.48,50.39 29.31,46.23 U$9.P$2
N$8
  Bottom 0.203: R5.2 156.77,58.42 156.87,58.52 159.46,58.52 159.56,58.42 D6.A
N$9
  Bottom 0.203: D5.A 53.75,50.8 59.49,45.06 59.69,45.06 R6.2
N$10
  Top 0.203: IC1.24 128.47,47.5 128.52,47.5 128.63,47.4 128.63,47.04 129.24,46.43 129.24,46.38 131.67,43.94 139.09,43.94 139.09,43.54 139.8,42.82 140.26,42.82 C2.2 140.21,42.27 140.21,41.45 139.8,41.05 142.24,38.61 142.24,38.2 Q1.1
N$11
  Bottom 0.203: R9.2 156.77,54.61 156.87,54.71 159.46,54.71 159.56,54.61 D10.A
N$12
  Top 0.203: C1.1 135.03,42.27 132.33,42.27 129.29,45.31 129.29,45.36 128.37,46.28 128.37,46.48 127.91,46.94 127.86,46.94 IC1.23
  Bottom 0.203: Q1.2 136.96,38.2 136.96,40.23 135.33,41.86 C1.1
N$13  (via drill 0.4)
  Top 0.203: v113.64,58.88 113.59,58.83 113.59,56.84 114.05,56.39 114.05,56.24 114.5,55.78 114.55,55.78 IC1.62
  Bottom 0.203: v113.64,58.88 107.39,65.13 105.46,65.13 104.75,65.84 104.65,65.84 104.55,65.94 R8.1
N$14
  Top 2.54: U$4.1 6.5,59.74 9.35,56.9 10.57,58.12 10.97,58.12 12.6,59.74 R10.2 12.19,60.96 12.6,61.37 | 12.6,61.37 13.01,61.37 15.04,63.4 D7.A | U$7.P$1 6.1,69.9 5.28,69.09 5.28,67.46 10.16,62.59 11.38,62.59 12.6,61.37
N$15
  Top 0.203: D11.A 18.14,55.22 18.14,55.88 18.85,56.59 18.85,58.32 20.02,59.49 20.02,59.64 R10.1
N$17
  Bottom 0.203: D3.A 55.78,71.32 59.08,68.02 59.13,68.02 59.23,67.92 R11.2
N$18
  Top 0.203: D12.A 53.7,63.65 53.7,64.31 54.41,65.02 54.41,66.7 55.17,67.46 55.17,67.61 R4.1
N$19
  Top 0.203: D13.A 53.34,41.71 54.91,43.28 54.91,44.55 55.88,45.52 R12.1
N$20
  Top 1.27: 46.3,43.81 48.16,45.67 48.21,45.67 R12.2 | 46.3,43.81 44.76,42.27 42.47,44.55 U$6.1 41.96,44.15 39.93,42.11 30.84,42.11 30.63,41.91 30.28,42.27 U$9.P$1 | D9.A 45.72,52.12 45.67,52.12 43.99,50.44 43.99,46.79 45.57,45.21 45.57,44.55 46.3,43.81
  Bottom 1.27: R12.2 48.21,45.72
N$21
  Bottom 2.54: U$1.5 28.45,76.81 28.85,76.4 28.85,74.37 | 28.85,73.15 28.85,74.37 | 28.85,73.15 28.85,67.06 25.6,63.8 D7.C | U$7.P$2 10.16,70.31 13.01,73.15 28.85,73.15 | U$1.6 32.51,78.03 32.51,76 30.89,74.37 28.85,74.37
N$22
  Top 1.27: U$8.P$2 33.73,70.71 34.14,70.71 36.17,72.75 36.17,78.03 U$1.7
  Bottom 1.27: D8.C 48.77,77.22 44.7,81.28 39.01,81.28 36.58,78.84 36.58,78.03 U$1.7
PG_MISO
  Top 0.203: IC1.3 114.2,50.8 113.39,49.99 105.26,49.99 104.04,48.77 98.75,48.77 97.54,49.99 97.54,50.8 JP2.1
PG_MOSI
  Top 0.203: IC1.2 113.79,51.21 112.98,50.39 104.85,50.39 103.63,49.17 102.82,49.17 101.6,50.39 101.6,51.21 102.01,51.61 100.38,53.24 JP2.4
SUP_1_RESV  (via drill 0.4)
  Top 0.203: v122.33,60.15 121.92,60.55 121.92,60.96 121.11,61.77 IC1.51 | v72.34,55.27 60.15,43.08 58.93,43.08 54.05,38.2 49.17,38.2 43.08,32.11 41.86,32.11 36.58,26.82 36.58,25.2 33.33,21.95 32.51,21.95 SUP_1.15
  Bottom 0.203: v122.33,60.15 121.92,59.74 121.51,59.74 120.29,58.52 120.29,57.3 117.86,54.86 116.23,54.86 115.42,55.68 105.66,55.68 105.26,56.08 95.91,56.08 95.1,55.27 v72.34,55.27
SUP_1_SS  (via drill 0.4, 0.5)
  Top 0.203: v91.44,29.67 91.44,21.13 90.3,19.99 arc-45 90.12,19.91 v45.52,19.91 41.15,19.91 arc-45 40.97,19.99 38.2,22.76 v38.2,26.21 | v130.05,46.74 130.05,47.09 129.08,48.06 129.03,48.06 IC1.25 | v96.83,35.36 v115.47,35.36
  Bottom 0.203: v38.2,26.21 26.21,26.21 26.21,23.16 SUP_1.11 | v115.47,35.36 117.65,37.54 128.57,37.54 arc45 128.75,37.62 130.05,38.92 v130.05,46.74 | v96.83,35.36 93.42,31.95 92.05,31.95 91.19,31.09 91.19,30.23 91.44,29.97 v91.44,29.67
SUP_2_RESV  (via drill 0.4, 0.5)
  Top 0.203: v47.55,20.73 47.55,28.04 93.88,74.37 104.44,74.37 v108.1,70.71 | v121.11,70.71 121.11,64.21 120.7,63.8 120.7,63.18 IC1.50
  Bottom 0.203: v47.55,20.73 50.8,17.48 50.8,11.38 47.55,8.13 33.33,8.13 32.92,7.72 32.51,7.72 SUP_2.15 | v108.1,70.71 v121.11,70.71
SUP_2_SS  (via drill 0.4, 0.5)
  Top 0.203: v92.66,30.48 92.66,20.73 91.03,19.1 41.45,19.1 41.12,19.43 arc45 40.94,19.51 v39.42,19.51 | v35.76,15.04 35.76,5.69 34.14,4.06 29.26,4.06 27.64,5.69 SUP_2.11 | v131.27,46.74 130.45,47.55 130.45,48.11 130.2,48.11 129.64,48.67 129.59,48.67 IC1.26 | v119.84,34.54 98.09,34.54 v97.89,34.34
  Bottom 0.203: v39.42,19.51 38.51,18.59 38.46,18.59 36.73,16.87 36.73,16 v35.76,15.04 | v119.84,34.54 120.65,34.54 122.53,36.42 128.83,36.42 130.66,38.25 arc45 130.74,38.29 131.27,38.81 v131.27,46.74 | v97.89,34.34 95.5,31.95 94.13,31.95 v92.66,30.48
SUP_3_RESV  (via drill 0.4)
  Top 0.203: v122.73,63.8 122.33,63.4 121.92,63.4 IC1.49 | v93.47,56.9 82.91,46.33 82.91,31.29 80.06,28.45 78.84,28.45 71.53,21.13 70.71,21.95 SUP_3.15
  Bottom 0.203: v122.73,63.8 121.11,62.18 120.7,62.18 116.64,58.12 112.98,58.12 112.17,58.93 98.75,58.93 96.72,56.9 v93.47,56.9
SUP_3_SS  (via drill 0.4, 0.5, 0.6)
  Top 0.203: v93.88,26.01 v93.88,29.67 | v131.27,47.95 131.27,48.16 130.2,49.23 130.15,49.23 IC1.27 | v66.65,26.01 66.65,23.57 66.24,23.16 66.65,22.76 65.43,21.54 SUP_3.11 | v103.58,33.73 v120.65,33.73
  Bottom 0.203: v93.88,26.01 93.47,26.42 67.06,26.42 v66.65,26.01 | v103.58,33.73 99.06,29.21 95.25,29.21 94.79,29.67 94.74,29.67 94.44,29.97 94.18,29.97 v93.88,29.67 | v131.27,47.95 132.21,47.01 arc-45 132.28,46.83 132.28,39.01 129.24,35.97 122.99,35.97 arc45 122.81,35.89 v120.65,33.73
SUP_4_RESV  (via drill 0.4)
  Top 0.203: v133.91,52.48 133.71,52.48 133.55,52.32 132.84,53.03 132.59,53.03 132.49,52.93 124.1,61.32 124.1,61.77 124.31,61.98 124.05,62.23 124.05,62.43 124.26,62.64 124.26,62.89 IC1.48 | v93.67,21.08 94.84,22.25 98.7,22.25 arc45 98.88,22.32 v106.12,29.57
  Bottom 0.203: v133.91,52.48 133.15,51.71 132.94,51.71 131.06,49.84 131.06,49.38 131.98,48.46 132.03,48.46 133.1,47.4 133.1,39.17 arc-45 133.02,38.99 123.6,29.57 v106.12,29.57 | v93.67,21.08 80.26,7.67 71.02,7.67 70.97,7.62 SUP_4.15
SUP_4_SS  (via drill 0.4, 0.5)
  Top 0.203: v95.1,25.2 v95.1,30.48 | 130.76,49.78 130.71,49.78 IC1.28 130.45,49.99 126.8,53.65 v125.98,52.83 | v124.36,51.61 122.73,51.61 v119.48,48.36 | v102.41,36.17 v113.79,47.55
  Bottom 0.203: v95.1,25.2 95.1,6.91 92.66,5.28 67.06,5.28 SUP_4.11 | v95.1,30.48 96.11,31.5 100.74,31.5 100.74,34.95 101.19,34.95 v102.41,36.17 | v125.98,52.83 124.77,51.61 v124.36,51.61 | v119.48,48.36 118.67,47.55 v113.79,47.55
SUP_5_RESV  (via drill 0.5, 0.6)
  Top 0.203: 125.07,62.53 IC1.47 125.12,62.59 127.56,65.02 v127.61,65.02 | v135.74,10.16 136.14,9.75 136.14,6.91 138.18,4.88 140.21,4.88 v141.02,5.69
  Bottom 0.203: 156.9,3.62 156.46,3.25 143.46,3.25 v141.02,5.69 | 156.9,3.62 165,10.57 165,35.36 145.57,54.79 arc-45 145.49,54.97 145.49,63.4 143.13,65.76 arc45 142.95,65.84 128.42,65.84 v127.61,65.02 | SUP_5.15 125.98,21.54 127.61,19.91 127.61,11.79 128.42,10.97 132.89,10.97 133.71,10.16 v135.74,10.16 | 156.9,3.62 156.87,3.66
SUP_5_SS  (via drill 0.4)
  Top 0.203: v108.92,38.2 110.13,39.42 110.13,41.45 115.01,46.33 115.01,48.36 115.42,48.77 115.82,48.77 116.23,49.17 IC1.6 | v117.86,30.48 117.86,26.01 118.67,25.2 118.26,24.79 118.26,22.76 119.08,21.95 SUP_5.11
  Bottom 0.203: v108.92,38.2 109.73,37.39 110.95,37.39 v117.86,30.48
SUP_6_RESV  (via drill 0.5)
  Top 0.203: SUP_6.15 128.02,4.47 v144.27,4.47 | 125.63,61.98 IC1.46 125.68,62.03 125.98,62.33 126.14,62.33 v127.61,63.8
  Bottom 0.203: v144.27,4.47 156.46,4.47 163.37,10.57 163.37,35.36 144.75,53.98 arc-45 144.68,54.16 144.68,62.99 142.65,65.02 128.83,65.02 v127.61,63.8
SUP_6_SS  (via drill 0.4)
  Top 0.203: v108.1,36.17 110.54,38.61 110.54,41.05 115.82,46.33 115.82,47.55 116.64,48.36 IC1.7 | v113.79,30.48 113.79,27.23 115.82,25.2 115.42,24.79 115.42,23.57 116.23,22.76 115.42,21.95 115.42,21.13 115.01,20.73 115.01,20.32 v113.79,19.1
  Bottom 0.203: v113.79,30.48 v108.1,36.17 | v113.79,19.1 111.76,17.07 110.54,17.07 109.32,15.85 109.32,13.01 112.17,13.01 112.98,12.19 117.04,12.19 118.26,10.97 118.26,8.94 119.48,7.72 SUP_6.11
SUP_7_RESV  (via drill 0.5)
  Top 0.203: 126.19,61.42 IC1.45 126.24,61.47 126.54,61.77 126.8,61.77 v129.24,64.21 | v159.31,21.54 162.15,24.38 v162.15,24.79
  Bottom 0.203: SUP_7.15 v159.31,21.54 | v129.24,64.21 142.24,64.21 143.87,62.59 143.87,53.34 arc45 143.94,53.16 162.15,34.95 v162.15,24.79
SUP_7_SS  (via drill 0.4)
  Top 0.203: v133.3,36.98 115.01,36.98 113.79,35.76 110.13,35.76 109.73,36.17 109.73,36.98 110.95,38.2 110.95,40.64 116.23,45.92 116.23,47.14 117.04,47.95 IC1.8
  Bottom 0.203: v133.3,36.98 140.21,30.07 149.15,30.07 150.77,28.45 150.77,25.6 149.96,24.79 149.96,22.76 150.37,22.35 151.18,22.35 151.59,21.95 151.59,21.54 151.18,21.54 SUP_7.11
SUP_8_RESV  (via drill 0.5)
  Top 0.203: 126.75,60.86 IC1.44 126.8,60.91 127.1,61.21 127.46,61.21 v129.24,62.99
  Bottom 0.203: SUP_8.15 157.07,7.62 arc45 157.25,7.69 160.93,11.38 160.93,34.34 160.88,34.39 160.83,34.39 142.84,52.39 arc45 142.75,52.43 142.75,61.87 141.71,62.92 arc45 141.53,62.99 v129.24,62.99
SUP_8_SS  (via drill 0.4)
  Top 0.203: v120.29,50.39 118.67,48.77 118.67,48.36 118.26,47.95 118.26,47.55 IC1.9 | v129.24,42.27 137.36,34.14 141.43,34.14 150.37,25.2 149.96,24.79 149.96,21.13 151.59,19.51 151.18,19.1 151.18,15.85 150.77,15.44 150.77,11.38 149.96,10.57 149.96,8.94 151.18,7.72 SUP_8.11
  Bottom 0.203: v120.29,50.39 122.33,48.36 122.33,44.3 123.55,44.3 125.58,42.27 126.39,42.27 127.2,43.08 128.42,43.08 v129.24,42.27
VCC  (via drill 0.4)
  Top 0.203: v119.08,62.18 119.48,61.77 119.89,61.77 IC1.52 120.29,61.42 121.21,60.5 121.21,55.88 126.9,50.19 126.9,48.16 127.25,47.8 127.25,47.65 126.29,46.69 126.29,46.58 126.49,46.38 126.49,46.02 126.64,45.87 IC1.21 126.8,45.92 127.2,45.52 127.2,43.08 125.17,41.05 124.77,41.05 C3.2
  Bottom 0.203: 119.08,63.4 119.48,63.4 121.11,65.02 121.11,66.24 119.89,67.46 119.89,68.28 119.48,68.28 C4.2 | 119.08,63.4 117.45,63.4 114.61,66.24 106.48,66.24 L2.1 | v119.08,62.18 119.08,63.4

### Text on the board
tNames: TrainUtilizingSystem
tValues: EthernetBoard Rev.A | https://github.com/sosoru/TrainUtilizingSystem
200bmp: C:/Users/root/Desktop/tus.bmp